# Altium schematic sheet MCU.SchDoc: MCU
size Letter; DocumentNumber: 2; SheetNumber: 3; SheetTotal: 11
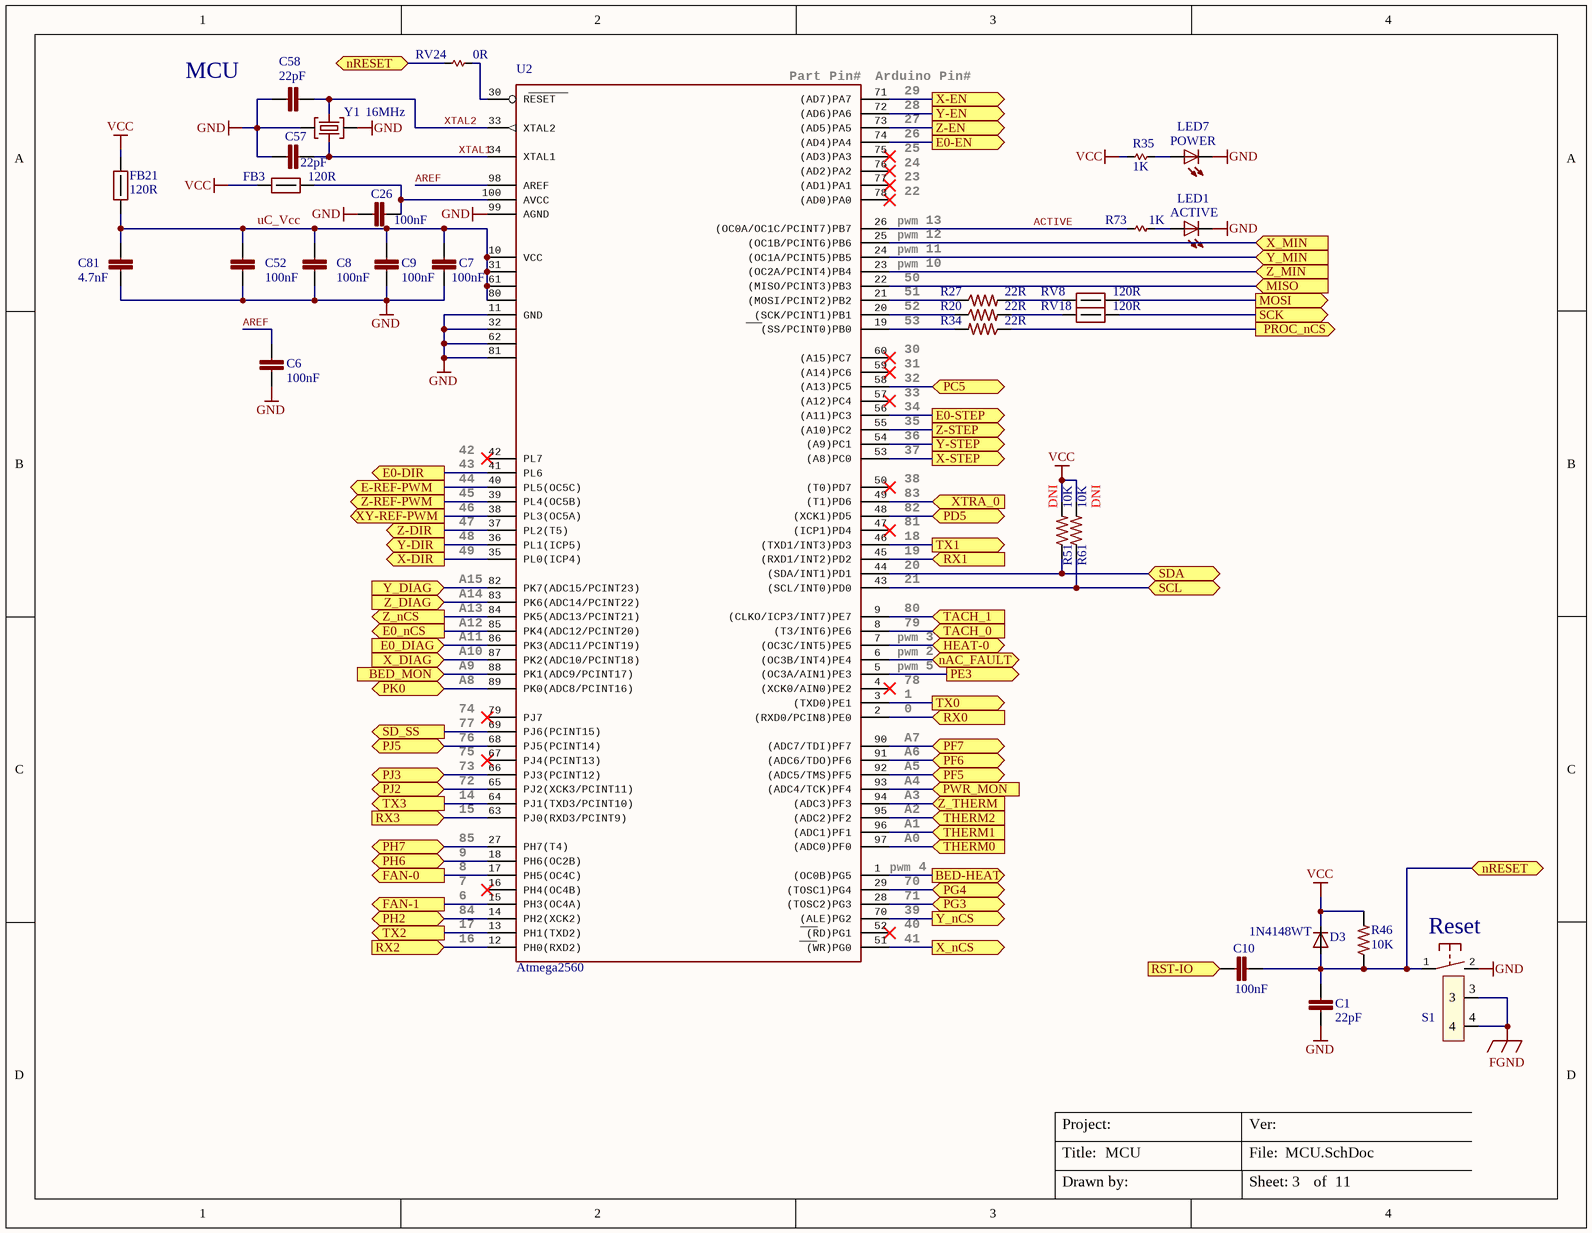
[diagram p0: MCU.SchDoc]

## Parts
C1  22pF  [C0402]
C6  100nF  [C0402]
C7  100nF  [C0402]
C8  100nF  [C0402]
C9  100nF  [C0402]
C10  100nF  [C0402]
C26  100nF  [C0402]
C52  100nF  [C0402]
C57  22pF  [C0402]
C58  22pF  [C0402]
C81  4.7nF  [C0402]
D3  1N4148WT  [SOD523]
FB3  120R  [FB0603]
FB21  120R  [FB0603]
LED1  YEL  [LED2012120]  (value not drawn)
LED7  GRN  [LED2012120]  (value not drawn)
R20  22R  [R0402]
R27  22R  [R0402]
R34  22R  [R0402]
R35  1K  [R0402]
R46  10K  [R0402]
R51  10K  [R0402]
R61  10K  [R0402]
R73  1K  [R0402]
RV8  120R  [R0402]
RV18  120R  [R0402]
RV24  0R  [R0402]
S1  1571610-2  [B3F-31XX]  (value not drawn)
U2  Atmega2560  [TSQFP50P1600X1600X120-100L]
Y1  value 16MHz  [CRYS320250]  (hidden comment: 7M-16.000MEEQ-T)

## Ports
BED-HEAT, BED_MON, E0-DIR, E0-EN, E0-STEP, E0_DIAG, E0_nCS, E-REF-PWM, FAN-0, FAN-1, HEAT-0, MISO, MOSI, nAC_FAULT, nRESET, PC5, PD5, PE3, PF5, PF6, PF7, PG3, PG4, PH2, PH6, PH7, PJ2, PJ3, PJ5, PK0, PROC_nCS, PWR_MON, RST-IO, RX0, RX1, RX2, RX3, SCK, SCL, SD_SS, SDA, TACH_0, TACH_1, THERM0, THERM1, THERM2, TX0, TX1, TX2, TX3, X-DIR, X-EN, X-STEP, X_DIAG, X_MIN, X_nCS, XTRA_0, XY-REF-PWM, Y-DIR, Y-EN, Y-STEP, Y_DIAG, Y_MIN, Y_nCS, Z-DIR, Z-EN, Z-REF-PWM, Z-STEP, Z_DIAG, Z_MIN, Z_nCS, Z_THERM

## Nets
FGND: S1.3 S1.4
GND: C1.2 C6.2 C7.2 C8.2 C9.2 C26.2 C52.2 C57.2 C58.2 C81.2 LED1.C LED7.C S1.2(S) U2.11(GND) U2.32(GND1) U2.62(GND2) U2.81(GND3) U2.99(AGND) Y1.2(GND) Y1.4(GND)
VCC: D3.C FB3.1 FB21.1 R35.2 R46.2 R51.2 R61.2
ACTIVE: R73.2 U2.26((OC0A/OC1C/PCINT7)PB7)
AREF: C6.1 U2.98(AREF)
BED-HEAT: U2.1((OC0B)PG5) ; port BED-HEAT
BED_MON: U2.88(PK1(ADC9/PCINT17)) ; port BED_MON
E0-DIR: U2.41(PL6) ; port E0-DIR
E0-EN: U2.74((AD4)PA4) ; port E0-EN
E0-STEP: U2.56((A11)PC3) ; port E0-STEP
E0_DIAG: U2.86(PK3(ADC11/PCINT19)) ; port E0_DIAG
E0_nCS: U2.85(PK4(ADC12/PCINT20)) ; port E0_nCS
E-REF-PWM: U2.40(PL5(OC5C)) ; port E-REF-PWM
FAN-0: U2.17(PH5(OC4C)) ; port FAN-0
FAN-1: U2.15(PH3(OC4A)) ; port FAN-1
HEAT-0: U2.7((OC3C/INT5)PE5) ; port HEAT-0
MISO: U2.22((MISO/PCINT3)PB3) ; port MISO
MOSI: RV8.2 ; port MOSI
nAC_FAULT: U2.6((OC3B/INT4)PE4) ; port nAC_FAULT
nRESET: C1.1 C10.2 D3.A R46.1 RV24.1 S1.1(P) ; port nRESET
PC5: U2.58((A13)PC5) ; port PC5
PD5: U2.48((XCK1)PD5) ; port PD5
PE3: U2.5((OC3A/AIN1)PE3) ; port PE3
PF5: U2.92((ADC5/TMS)PF5) ; port PF5
PF6: U2.91((ADC6/TDO)PF6) ; port PF6
PF7: U2.90((ADC7/TDI)PF7) ; port PF7
PG3: U2.28((TOSC2)PG3) ; port PG3
PG4: U2.29((TOSC1)PG4) ; port PG4
PH2: U2.14(PH2(XCK2)) ; port PH2
PH6: U2.18(PH6(OC2B)) ; port PH6
PH7: U2.27(PH7(T4)) ; port PH7
PJ2: U2.65(PJ2(XCK3/PCINT11)) ; port PJ2
PJ3: U2.66(PJ3(PCINT12)) ; port PJ3
PJ5: U2.68(PJ5(PCINT14)) ; port PJ5
PK0: U2.89(PK0(ADC8/PCINT16)) ; port PK0
PROC_nCS: R34.1 ; port PROC_nCS
PWR_MON: U2.93((ADC4/TCK)PF4) ; port PWR_MON
RST-IO: C10.1 ; port RST-IO
RX0: U2.2((RXD0/PCIN8)PE0) ; port RX0
RX1: U2.45((RXD1/INT2)PD2) ; port RX1
RX2: U2.12(PH0(RXD2)) ; port RX2
RX3: U2.63(PJ0(RXD3/PCINT9)) ; port RX3
SCK: RV18.2 ; port SCK
SCL: R61.1 U2.43((SCL/INT0)PD0) ; port SCL
SD_SS: U2.69(PJ6(PCINT15)) ; port SD_SS
SDA: R51.1 U2.44((SDA/INT1)PD1) ; port SDA
TACH_0: U2.8((T3/INT6)PE6) ; port TACH_0
TACH_1: U2.9((CLKO/ICP3/INT7)PE7) ; port TACH_1
THERM0: U2.97((ADC0)PF0) ; port THERM0
THERM1: U2.96((ADC1)PF1) ; port THERM1
THERM2: U2.95((ADC2)PF2) ; port THERM2
TX0: U2.3((TXD0)PE1) ; port TX0
TX1: U2.46((TXD1/INT3)PD3) ; port TX1
TX2: U2.13(PH1(TXD2)) ; port TX2
TX3: U2.64(PJ1(TXD3/PCINT10)) ; port TX3
uC_Vcc: C7.1 C8.1 C9.1 C52.1 C81.1 FB21.2 U2.10(VCC) U2.31(VCC1) U2.61(VCC2) U2.80(VCC3)
X-DIR: U2.35(PL0(ICP4)) ; port X-DIR
X-EN: U2.71((AD7)PA7) ; port X-EN
X-STEP: U2.53((A8)PC0) ; port X-STEP
X_DIAG: U2.87(PK2(ADC10/PCINT18)) ; port X_DIAG
X_MIN: U2.25((OC1B/PCINT6)PB6) ; port X_MIN
X_nCS: U2.51((WR)PG0) ; port X_nCS
XTAL1: C57.1 U2.34(XTAL1) Y1.1(C1)
XTAL2: C58.1 U2.33(XTAL2) Y1.3(C2)
XTRA_0: U2.49((T1)PD6) ; port XTRA_0
XY-REF-PWM: U2.38(PL3(OC5A)) ; port XY-REF-PWM
Y-DIR: U2.36(PL1(ICP5)) ; port Y-DIR
Y-EN: U2.72((AD6)PA6) ; port Y-EN
Y-STEP: U2.54((A9)PC1) ; port Y-STEP
Y_DIAG: U2.82(PK7(ADC15/PCINT23)) ; port Y_DIAG
Y_MIN: U2.24((OC1A/PCINT5)PB5) ; port Y_MIN
Y_nCS: U2.70((ALE)PG2) ; port Y_nCS
Z-DIR: U2.37(PL2(T5)) ; port Z-DIR
Z-EN: U2.73((AD5)PA5) ; port Z-EN
Z-REF-PWM: U2.39(PL4(OC5B)) ; port Z-REF-PWM
Z-STEP: U2.55((A10)PC2) ; port Z-STEP
Z_DIAG: U2.83(PK6(ADC14/PCINT22)) ; port Z_DIAG
Z_MIN: U2.23((OC2A/PCINT4)PB4) ; port Z_MIN
Z_nCS: U2.84(PK5(ADC13/PCINT21)) ; port Z_nCS
Z_THERM: U2.94((ADC3)PF3) ; port Z_THERM
NetC26_1: C26.1 FB3.2 U2.100(AVCC)
NetLED1_A: LED1.A R73.1
NetLED7_A: LED7.A R35.1
NetR20_1: R20.1 U2.20((SCK/PCINT1)PB1)
NetR20_2: R20.2 RV18.1
NetR27_1: R27.1 U2.21((MOSI/PCINT2)PB2)
NetR27_2: R27.2 RV8.1
NetR34_2: R34.2 U2.19((SS/PCINT0)PB0)
NetRV24_2: RV24.2 U2.30(RESET)

Not connected (* = marked no-connect by the designer): U2 4((XCK0/AIN0)PE2)* 16(PH4(OC4B))* 42(PL7)* 47((ICP1)PD4)* 50((T0)PD7)* 52((RD)PG1)* 57((A12)PC4)* 59((A14)PC6)* 60((A15)PC7)* 67(PJ4(PCINT13))* 75((AD3)PA3)* 76((AD2)PA2)* 77((AD1)PA1)* 78((AD0)PA0)* 79(PJ7)*

## Notes on the sheet
- MCU
- (near U2) Part Pin#
- (near U2) Arduino Pin#
- (near U2) 28
- (near U2) 29
- (near U2) 24
- (near U2) 25
- (near U2) 26
- (near U2) 27
- (near LED7) POWER
- (near U2) pwm
- (near U2) 22
- (near U2) 23
- 11
- 12
- 13
- (near LED1) ACTIVE
- 50
- 51
- 52
- 10
- 30
- 31
- 32
- (near U2) 33
- 53
- (near U2) 42
- (near U2) 34
- (near U2) 35
- (near U2) 36
- (near U2) 37
- (near U2) 43
- (near U2) 44
- (near U2) 45
- (near U2) 46
- (near U2) 47
- (near U2) 48
- (near U2) 18
- (near U2) 38
- (near U2) 81
- (near U2) 82
- (near U2) 83
- (near U2) 49
- (near U2) A14
- (near U2) A15
- (near U2) 19
- (near U2) 20
- (near U2) 21
- (near U2) A8
- (near U2) A9
- (near U2) A10
- (near U2) A11
- (near U2) A12
- (near U2) A13
- (near U2) 78
- (near U2) 79
- (near U2) 80
- 2
- 3
- 5
- (near U2) 74
- (near U2) 76
- (near U2) 77
- (near U2) A7
- (near U2) 0
- (near U2) 1
- (near U2) 15
- (near U2) 14
- (near U2) 72
- (near U2) 73
- (near U2) 75
- (near U2) A6
- (near U2) A5
- (near U2) A4
- (near U2) A3
- (near U2) A2
- (near U2) A1
- (near U2) 7
- (near U2) 8
- (near U2) 9
- (near U2) 85
- (near U2) A0
- (near U2) 70
- 4
- (near U2) 6
- (near U2) 84
- (near U2) 16
- (near U2) 17
- (near U2) 39
- (near U2) 40
- (near U2) 41
- (near U2) 71
- (near S1) Reset
- Title:
- Project:
- File:
- Ver:
- Drawn by:
- Sheet:
- of

## Library data of the parts
C1 C57 C58 = 04025A220JAT2A: CAP CER 0402 22pF 50V 5% C0G; Manufacturer: AVX; Part Description: 22pF ±5% 50V Ceramic Capacitor C0G, NP0 0402 (1005 Metric); EE_SPEC: 22pF 5% 50V NP0 0402; VALUE: 22pF; MANUFACTURER #: 04025A220JAT2A; DISTRIBUTOR #: 478-1074-2-ND; DISTRIBUTOR: Digi-Key; PART: 22pF 50V; Tolerance: 5%
C6-C10 C26 C52 = GRM155R71C104KA88D: CAP CER 0402 100nF 16V 10% X7R; Manufacturer: Murata; Part Description: 0.10µF ±10% 16V Ceramic Capacitor X7R 0402 (1005 Metric); EE_SPEC: 100nF 16V X7R 0402; Tolerance: +/- 10%; VALUE: 100nF; MANUFACTURER #: GRM155R71C104KA88D; DISTRIBUTOR #: 490-3261-2-ND; DISTRIBUTOR: Digi-Key; PART: 100nF
C81 = CC0402KRX7R8BB472: CAP CER 0402 4.7nF 25V 10% X7R; Manufacturer: YAGEO; Part Description: 4700pF ±10% 25V Ceramic Capacitor X7R 0402 (1005 Metric); EE_SPEC: 4.7nF 25V X7R 0402; Tolerance: +/- 10%; VALUE: 4.7nF; MANUFACTURER #: CC0402KRX7R8BB472; DISTRIBUTOR #: 311-1039-2-ND; DISTRIBUTOR: Digi-Key; PART: 4.7nF
D3 = 1N4148WT: DIODE SOD523; Manufacturer: Fairchild; Part Description: DIODE GEN PURP 75V 200MA SOD523F; EE_SPEC: 75V 0.2A; Tolerance: NA; Value: 1N4148WT; DISTRIBUTOR #: 1N4148WTTR-ND; DISTRIBUTOR: Digi-Key; MANUFACTURER #: 1N4148WT; PART: 1N4148WT
FB3 FB21 = FERRITE 120R 3A 0603: FERRITE BEAD 120 OHM 0603 1LN; MANUFACTURER: Samsung; MANUFACTURER #: CIS10P121AC; VALUE: 120Rfb; TOLERANCE: -NA-; EE_SPEC: 3A; DISTRIBUTOR #: 1276-6351-2-ND; PART: FERRITE 120R 3A 0603; PART DESCRIPTION: FERRITE BEAD 120 OHM 0603 1LN
  FB3: DISTRIBUTOR: DigiKey
  FB21: DISTRIBUTOR: Digikey
LED1 = 5988140107F: LED 0805 Yellow; Manufacturer: Dialight; Part Description: Yellow 593nm LED Indication - Discrete 2V 0805 (2012 Metric); EE_SPEC: 2V 0.02A; Tolerance: NA; VALUE: YEL; DISTRIBUTOR #: 350-2041-2-ND; DISTRIBUTOR: Digi-Key; MANUFACTURER #: 5988140107F; PART: YEL
LED7 = 5988170107F: LED 0805 Green; Manufacturer: Dialight; Part Description: Green 566nm LED Indication - Discrete 2V 0805 (2012 Metric); EE_SPEC: 2V 0.02A; Tolerance: NA; VALUE: GRN; DISTRIBUTOR #: 350-2044-2-ND; DISTRIBUTOR: Digi-Key; MANUFACTURER #: 5988170107F; PART: GRN
R20 R27 R34 = RC0402FR-0722RL: RES 0402 22r 62.5mW 1%; Manufacturer: Yageo; Part Description: 22 Ohm ±1% 0.063W, 1/16W Chip Resistor 0402 (1005 Metric) Moisture Resistant Thick Film; EE_SPEC: 22R 1% 0402; Tolerance: +/- 1%; VALUE: 22R; DISTRIBUTOR #: 311-22.0LRTR-ND; DISTRIBUTOR: Digi-Key; MANUFACTURER #: RC0402FR-0722RL; PART: 22R
R35 R73 = RC0402FR-071KL: RES SMD 1K OHM 1% 1/16W 0402; Manufacturer: Yageo; Part Description: 1k Ohm ±1% 0.063W, 1/16W Chip Resistor 0402 (1005 Metric) Moisture Resistant Thick Film; EE_SPEC: 1k 1% 0402; Tolerance: +/- 1%; VALUE: 1K; MANUFACTURER #: RC0402FR-071KL; DISTRIBUTOR #: 311-1.00KLRTR-ND; DISTRIBUTOR: Digi-Key; PART: 1k
R46 R51 R61 = RC0402FR-0710KP: RES SMD 10K OHM 1% 1/16W 0402; MANUFACTURER: Yageo; PART: 10k 1% 0402; PART DESCRIPTION: 10k Ohm ±1% 0.063W, 1/16W Chip Resistor 0402 (1005 Metric) Moisture Resistant Thick Film; EE_SPEC: 10k 1% 0402 1/16W; VALUE: 10K; MANUFACTURER #: RC0402FR-0710KP; DISTRIBUTOR #: YAG1249TR-ND; DISTRIBUTOR: Digi-Key; TOLERANCE: 1%
  R51 R61: DNI: DNI
RV8 RV18 = FERRITE 120R 1A 0402: FERRITE BEAD 120 OHM 0402 1LN; MANUFACTURER: Taiyo Yuden; MANUFACTURER #: BKP1005HS121-T; VALUE: 120Rfb; TOLERANCE: -NA-; EE_SPEC: 1A; DISTRIBUTOR #: 587-1921-2-ND; DISTRIBUTOR: Digikey; PART: FERRITE 120R 1A 0402; PART DESCRIPTION: FERRITE BEAD 120 OHM 0402 1LN
RV24 = 0R 0402: RES SMD 0.0OHM JUMPER 1/10W 0402; MANUFACTURER: Panasonic; MANUFACTURER #: ERJ-2GE0R00X; PART DESCRIPTION: 0.0 Ohm Jumper 0.1W, 1/10W Chip Resistor 0402 (1005 Metric) Automotive AEC-Q200 Thick Film; MANUFACTURER2#: RC0402JR-070RL; TOLERANCE: 1%; DISTRIBUTOR #: P0.0JTR-ND; DISTRIBUTOR: Digikey; PART: 0R; VALUE: 0R
S1 = 1571610-2: SWTCH Momentary Washable; Manufacturer: TE; PART: Tact PB R/A; Part Description: Tactile Switches R/A SEALED TACT SWITCH; EE_SPEC: 24V 0.05A; Tolerance: NA; VALUE: Tact PB R/A; DISTRIBUTOR #: 506-1571610-2; DISTRIBUTOR: Digi-Key; MANUFACTURER #: 1571610-2
U2 = ATMEGA2560AU_SM: Manufacturer: Microchip; MANUFACTURER #: ATMEGA2560-16AUR; Part Description: AVR AVR® ATmega Microcontroller IC 8-Bit 16MHz 256KB (128K x 16) FLASH 100-TQFP (14x14); EE_SPEC: 5V 256KB 8KB 16MHz; Tolerance: NA; DISTRIBUTOR #: ATMEGA2560-16AURTR-ND; DISTRIBUTOR: Digi-Key; PART: ATMEGA2560; VALUE: ATMEGA2560
Y1 = 7M-16.000MEEQ-T: Crystal 16mHz 10ppm 10pF; Manufacturer: TXC; Part Description: CRYSTAL 16.0000MHZ 10PF SMD; EE_SPEC: 10ppm 10pF 80R; MANUFACTURER #: 7M-16.000MEEQ-T; DISTRIBUTOR #: 887-1319-2-ND; DISTRIBUTOR: Digi-Key; PART: 16MHz; Tolerance: 10ppm